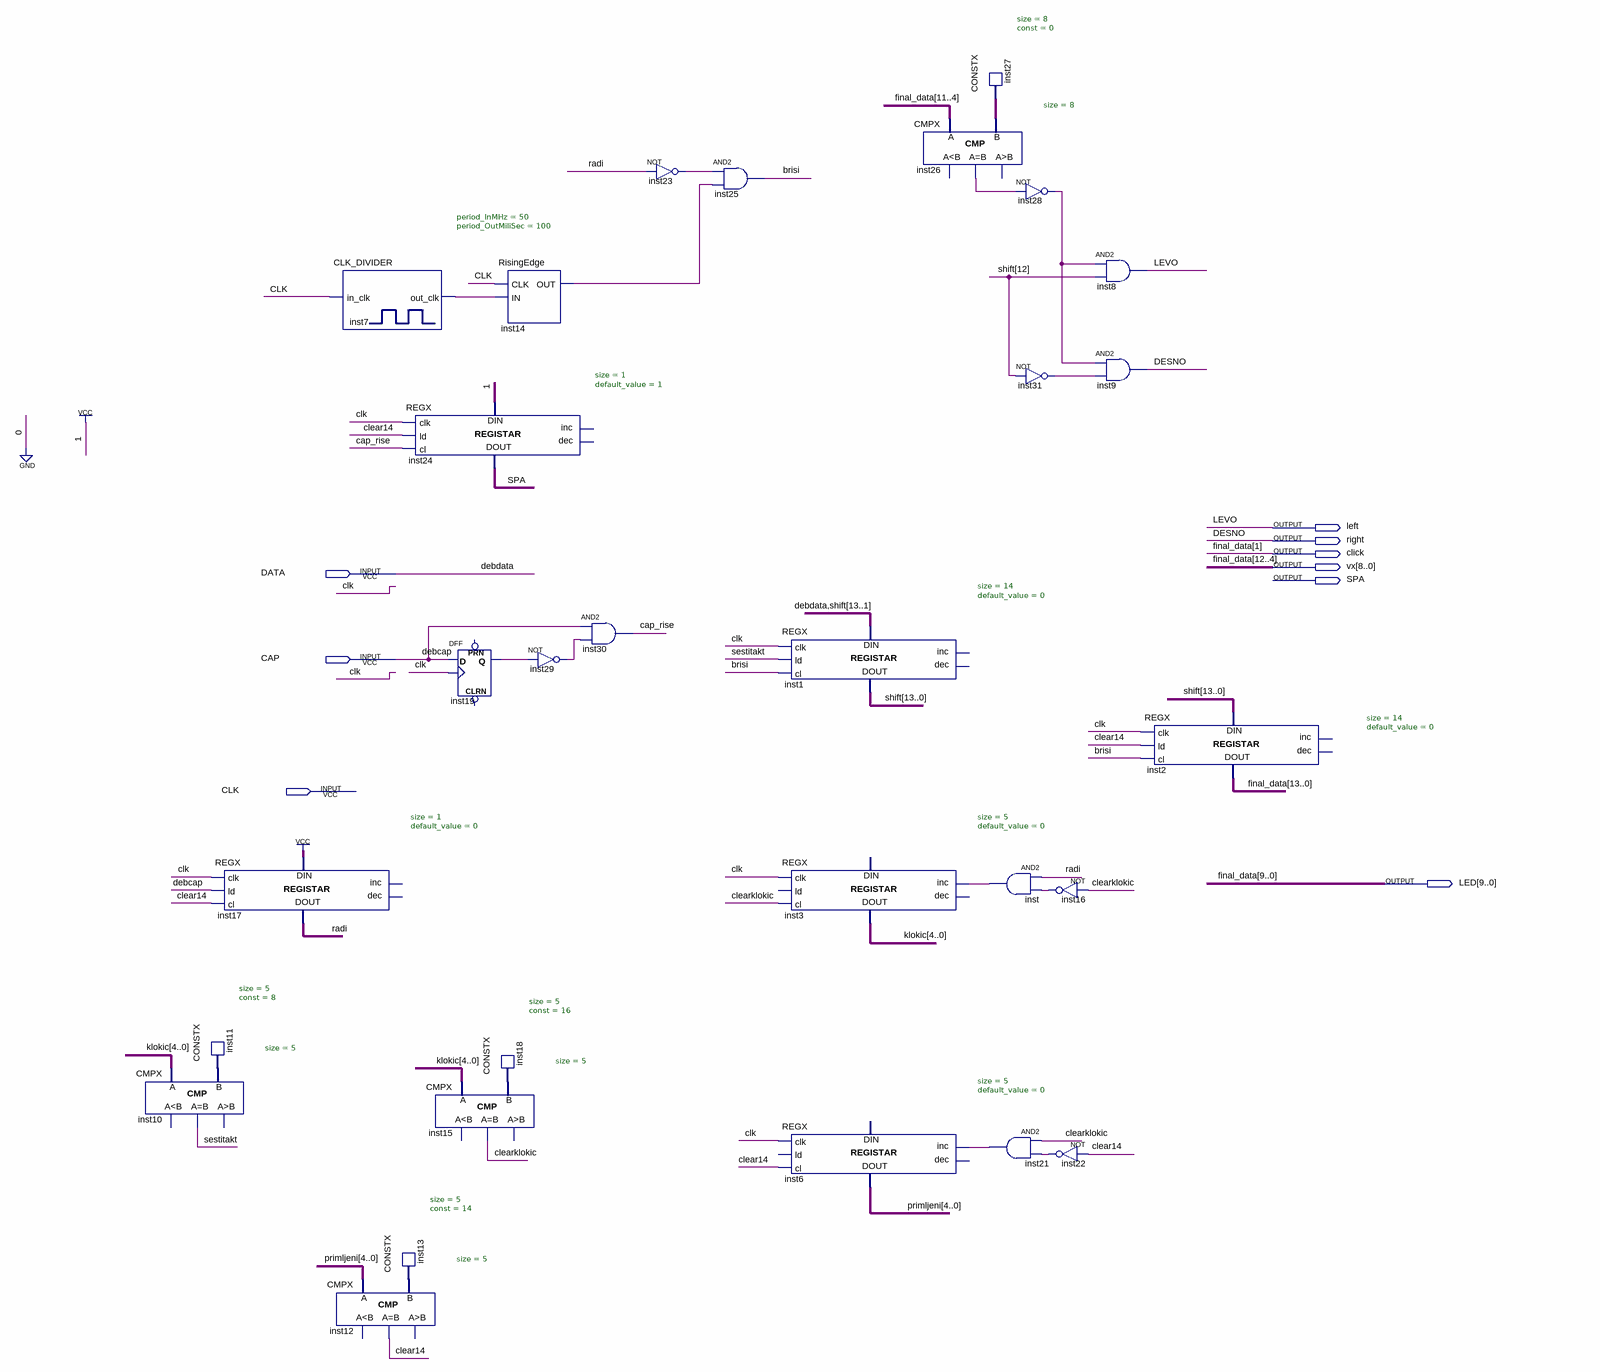
[diagram p0: schematic sheet]
// Quartus schematic primam.bdf as structural Verilog: 29 symbols, 9 pins
module primam (
  input  DATA,
  input  CAP,
  input  CLK,
  output left,
  output right,
  output click,
  output [8:0] vx,
  output SPA,
  output [9:0] LED
);

  wire brisi, cap_rise, clear14, clearklokic, inst7_out_clk, inst14_out, inst16_out, inst19_q, inst21_out,
       inst22_out, inst23_out, inst26_eq, inst28_out, inst29_out, inst31_out, inst_out, radi, sestitakt;
  wire [4:0] inst11_data, inst13_data, inst18_data, klokic, primljeni;
  wire [7:0] inst27_data;
  wire [13:0] shift;
  wire [13:13] final_data;

  CMPX #(.size(5)) inst10 (.A(klokic), .B(inst11_data), .eq(sestitakt));  // open: ls, gr
  CONSTX #(.size(5), .\const (8)) inst11 (.data(inst11_data));
  REGX #(.size(1), .default_value(0)) inst17 (
    .clk(CLK), .ld(CAP), .cl(clear14), .data_in(1'b1), .data_out(radi));  // open: inc, dec
  CLK_DIVIDER #(.period_InMHz(50), .period_OutMiliSec(100)) inst7 (.in_clk(CLK), .out_clk(inst7_out_clk));
  CMPX #(.size(5)) inst12 (.A(primljeni), .B(inst13_data), .eq(clear14));  // open: ls, gr
  REGX #(.size(1), .default_value(1)) inst24 (
    .clk(CLK), .ld(clear14), .cl(cap_rise), .data_in(1'b1), .data_out(SPA));  // open: inc, dec
  CONSTX #(.size(5), .\const (14)) inst13 (.data(inst13_data));
  DFF inst19 (.CLK(CLK), .D(CAP), .Q(inst19_q));  // open: CLRN, PRN
  CMPX #(.size(5)) inst15 (.A(klokic), .B(inst18_data), .eq(clearklokic));  // open: ls, gr
  RisingEdge inst14 (.CLK(CLK), .IN(inst7_out_clk), .OUT(inst14_out));
  CONSTX #(.size(5), .\const (16)) inst18 (.data(inst18_data));
  not inst29 (inst29_out, inst19_q);
  and inst30 (cap_rise, CAP, inst29_out);
  not inst23 (inst23_out, radi);
  and inst25 (brisi, inst23_out, inst14_out);
  REGX #(.size(14), .default_value(0)) inst1 (
    .clk(CLK), .ld(sestitakt), .cl(brisi), .data_in({DATA, shift[13:1]}), .data_out(shift));  // open: inc, dec
  REGX #(.size(5), .default_value(0)) inst3 (
    .clk(CLK), .cl(clearklokic), .inc(inst_out), .data_out(klokic));  // open: ld, dec, data_in
  REGX #(.size(5), .default_value(0)) inst6 (
    .clk(CLK), .cl(clear14), .inc(inst21_out), .data_out(primljeni));  // open: ld, dec, data_in
  CMPX #(.size(8)) inst26 (.A({vx[7:6], LED[9:4]}), .B(inst27_data), .eq(inst26_eq));  // open: ls, gr
  CONSTX #(.size(8), .\const (0)) inst27 (.data(inst27_data));
  and inst (inst_out, radi, inst16_out);
  and inst21 (inst21_out, clearklokic, inst22_out);
  not inst28 (inst28_out, inst26_eq);
  not inst31 (inst31_out, shift[12]);
  not inst16 (inst16_out, clearklokic);
  not inst22 (inst22_out, clear14);
  and inst8 (left, inst28_out, shift[12]);
  and inst9 (right, inst28_out, inst31_out);
  REGX #(.size(14), .default_value(0)) inst2 (
    .clk(CLK), .ld(clear14), .cl(brisi), .data_in(shift),
    .data_out({final_data[13], vx[8:6], LED[9:2], click, LED[0]}));  // open: inc, dec

  assign LED[1] = click;
  assign vx[5:0] = LED[9:4];

  // Other names for the same wires on the sheet: debcap = CAP; debdata = DATA; DESNO = right;
  //   final_data[12:0] = {vx[8:6], LED[9:2], click, LED[0]}; LEVO = left
endmodule
